# EAGLE design main (EAGLE 7.2.0)
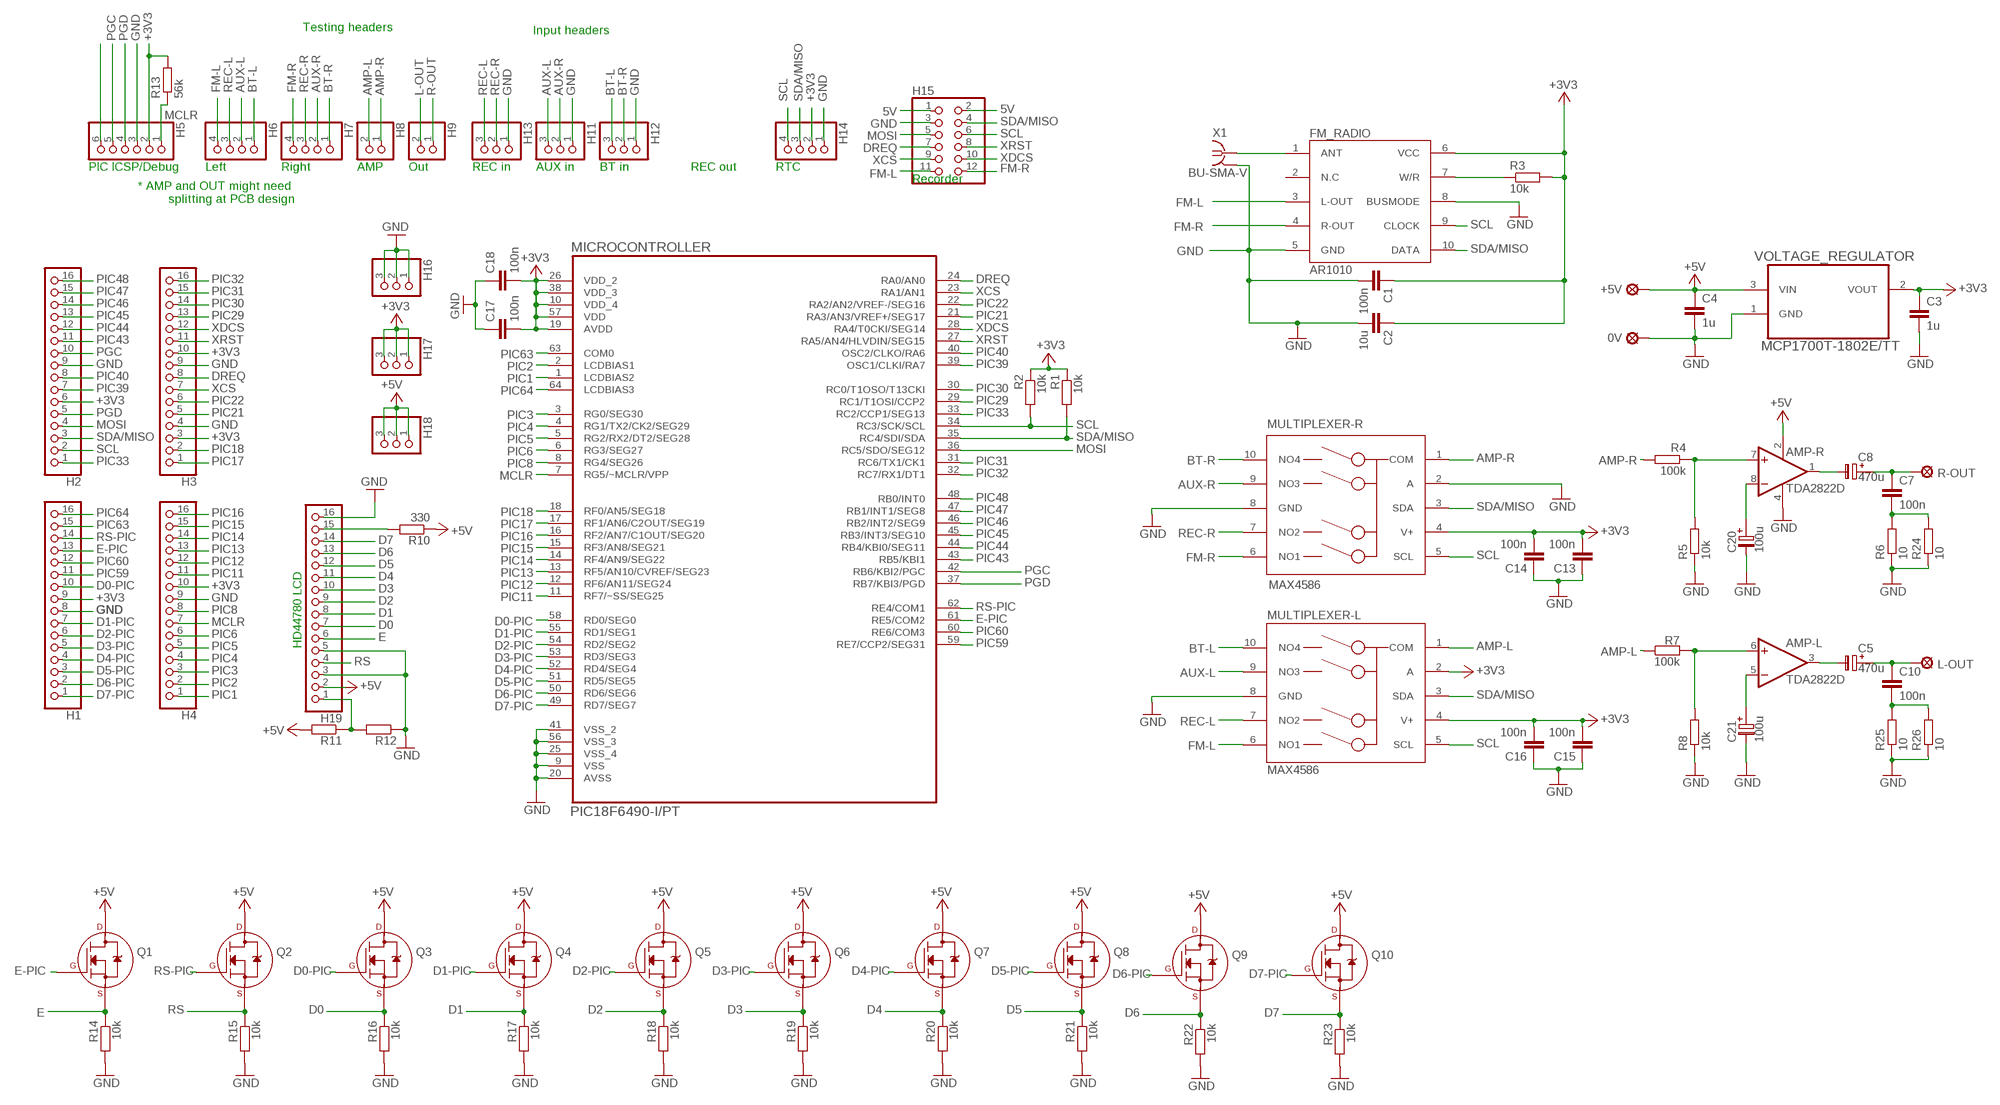
[diagram p0: schematic, sheet 1]

## Parts
0V  LSP11  [LSP11]
+5V  LSP11  [LSP11]
AMP-  TDA2822D  [SO08]
C1  100n  C-EUC0805  [C0805]
C2  10u  C-EUC0805  [C0805]
C3  1u  C-EUC0805  [C0805]
C4  1u  C-EUC0805  [C0805]
C5  470u  C-PR-SMD-SV-G  [SV-G]
C7  100n  C-EUC0805  [C0805]
C8  470u  C-PR-SMD-SV-G  [SV-G]
C10  100n  C-EUC0805  [C0805]
C13  100n  C-EUC0805  [C0805]
C14  100n  C-EUC0805  [C0805]
C15  100n  C-EUC0805  [C0805]
C16  100n  C-EUC0805  [C0805]
C17  100n  C-EUC0805  [C0805]
C18  100n  C-EUC0805  [C0805]
C20  100u  C-PR-SMD-SV-D  [SV-D]
C21  100u  C-PR-SMD-SV-D  [SV-D]
H1  PINHD-1X16  [1X16]
H2  PINHD-1X16  [1X16]
H3  PINHD-1X16  [1X16]
H4  PINHD-1X16  [1X16]
H5  PINHD-1X6  [1X06]
H6  PINHD-1X4  [1X04]
H7  PINHD-1X4  [1X04]
H8  PINHD-1X2  [1X02]
H9  PINHD-1X2  [1X02]
H11  PINHD-1X3  [1X03]
H12  PINHD-1X3  [1X03]
H13  PINHD-1X3  [1X03]
H14  PINHD-1X4/90  [1X04/90]
H15  PINHD-2X6  [2X06]
H16  PINHD-1X3  [1X03]
H17  PINHD-1X3  [1X03]
H18  PINHD-1X3  [1X03]
H19  PINHD-1X16  [1X16]
L-OUT  LSP10  [LSP10]
MICROCONTROLLER  PIC18F6490-I/PT  [QFP50P1200X1200X120-64N]
Q1  2N7000_SOT23  [SOT-23]
Q2  2N7000_SOT23  [SOT-23]
Q3  2N7000_SOT23  [SOT-23]
Q4  2N7000_SOT23  [SOT-23]
Q5  2N7000_SOT23  [SOT-23]
Q6  2N7000_SOT23  [SOT-23]
Q7  2N7000_SOT23  [SOT-23]
Q8  2N7000_SOT23  [SOT-23]
Q9  2N7000_SOT23  [SOT-23]
Q10  2N7000_SOT23  [SOT-23]
R1  10k  R-EU_M0805  [M0805]
R2  10k  R-EU_M0805  [M0805]
R3  10k  R-EU_M0805  [M0805]
R4  100k  R-EU_M0805  [M0805]
R5  10k  R-EU_M0805  [M0805]
R6  10  R-EU_M0805  [M0805]
R7  100k  R-EU_M0805  [M0805]
R8  10k  R-EU_M0805  [M0805]
R10  330  R-EU_M0805  [M0805]
R11  R-EU_M0805  [M0805]
R12  R-EU_M0805  [M0805]
R13  56k  R-EU_M0805  [M0805]
R14  10k  R-EU_M0805  [M0805]
R15  10k  R-EU_M0805  [M0805]
R16  10k  R-EU_M0805  [M0805]
R17  10k  R-EU_M0805  [M0805]
R18  10k  R-EU_M0805  [M0805]
R19  10k  R-EU_M0805  [M0805]
R20  10k  R-EU_M0805  [M0805]
R21  10k  R-EU_M0805  [M0805]
R22  10k  R-EU_M0805  [M0805]
R23  10k  R-EU_M0805  [M0805]
R24  10  R-EU_M0805  [M0805]
R25  10  R-EU_M0805  [M0805]
R26  10  R-EU_M0805  [M0805]
R-OUT  LSP10  [LSP10]
U$1  MAX4586  [UMAX10]
U$2  AR1010  [AR1010]
U$3  MAX4586  [UMAX10]
VOLTAGE_REGULATOR  MCP1700T-1802E/TT  [SOT95P237X112-3N]
X1  BU-SMA-V  [BU-SMA-V]

## Nets
5V: H15.1 H15.2
+3V3: C1.1 C2.1 C3.1 C13.2 C14.2 C15.2 C16.2 C17.2 C18.2 H1.9 H2.6 H3.3 H3.10 H4.10 H5.2 H14.2 H17.1 H17.2 H17.3 MICROCONTROLLER.10(VDD_4) MICROCONTROLLER.19(AVDD) MICROCONTROLLER.26(VDD_2) MICROCONTROLLER.38(VDD_3) MICROCONTROLLER.57(VDD) R1.1 R2.1 R3.2 R13.2 U$1.4(V+) U$2.6(VCC) U$3.2(A) U$3.4(V+) VOLTAGE_REGULATOR.2(VOUT)
+5V: +5V.MP AMP-.2(R:V+) C4.1 H18.1 H18.2 H18.3 H19.2 Q1.3(D) Q2.3(D) Q3.3(D) Q4.3(D) Q5.3(D) Q6.3(D) Q7.3(D) Q8.3(D) Q9.3(D) Q10.3(D) R10.1 R11.2 VOLTAGE_REGULATOR.3(VIN)
AMP-L: H8.2 R7.1 U$3.1(COM)
AMP-R: H8.1 R4.2 U$1.1(COM)
AUX-L: H6.2 H11.3 U$3.9(NO3)
AUX-R: H7.2 H11.2 U$1.9(NO3)
BT-L: H6.1 H12.3 U$3.10(NO4)
BT-R: H7.1 H12.2 U$1.10(NO4)
D0: H19.7 Q3.2(S) R16.1
D0-PIC: H1.10 MICROCONTROLLER.58(RD0/SEG0) Q3.1(G)
D1: H19.8 Q4.2(S) R17.1
D1-PIC: H1.7 MICROCONTROLLER.55(RD1/SEG1) Q4.1(G)
D2: H19.9 Q5.2(S) R18.1
D2-PIC: H1.6 MICROCONTROLLER.54(RD2/SEG2) Q5.1(G)
D3: H19.10 Q6.2(S) R19.1
D3-PIC: H1.5 MICROCONTROLLER.53(RD3/SEG3) Q6.1(G)
D4: H19.11 Q7.2(S) R20.1
D4-PIC: H1.4 MICROCONTROLLER.52(RD4/SEG4) Q7.1(G)
D5: H19.12 Q8.2(S) R21.1
D5-PIC: H1.3 MICROCONTROLLER.51(RD5/SEG5) Q8.1(G)
D6: H19.13 Q9.2(S) R22.1
D6-PIC: H1.2 MICROCONTROLLER.50(RD6/SEG6) Q9.1(G)
D7: H19.14 Q10.2(S) R23.1
D7-PIC: H1.1 MICROCONTROLLER.49(RD7/SEG7) Q10.1(G)
DREQ: H3.8 H15.7 MICROCONTROLLER.24(RA0/AN0)
E: H19.6 Q1.2(S) R14.1
E-PIC: H1.13 MICROCONTROLLER.61(RE5/COM2) Q1.1(G)
FM-L: H6.4 H15.11 U$2.3(L-OUT) U$3.6(NO1)
FM-R: H7.4 H15.12 U$1.6(NO1) U$2.4(R-OUT)
GND: 0V.MP AMP-.4(R:V-) C1.2 C2.2 C3.2 C4.2 C13.1 C14.1 C15.1 C16.1 C17.1 C18.1 C20.- C21.- H1.8 H2.9 H3.4 H3.9 H4.9 H5.3 H11.1 H12.1 H13.1 H14.1 H15.3 H16.1 H16.2 H16.3 H19.3 H19.5 H19.16 MICROCONTROLLER.9(VSS) MICROCONTROLLER.20(AVSS) MICROCONTROLLER.25(VSS_4) MICROCONTROLLER.41(VSS_2) MICROCONTROLLER.56(VSS_3) R5.1 R6.1 R8.1 R12.1 R14.2 R15.2 R16.2 R17.2 R18.2 R19.2 R20.2 R21.2 R22.2 R23.2 R24.1 R25.1 R26.1 U$1.2(A) U$1.8(GND) U$2.5(GND) U$2.8(BUSMODE) U$3.8(GND) VOLTAGE_REGULATOR.1(GND) X1.2 X1.3 X1.4 X1.5
L-OUT: C5.+ C10.1 H9.2 L-OUT.MP
MCLR: H4.7 H5.1 MICROCONTROLLER.7(RG5/~MCLR/VPP) R13.1
MOSI: H2.4 H15.5 MICROCONTROLLER.36(RC5/SDO/SEG12)
N$1: AMP-.8(R:-IN) C20.+
N$3: R3.1 U$2.7(W/R)
N$4: U$2.1(ANT) X1.1
N$5: AMP-.3(L:OUT) C5.-
N$7: AMP-.1(R:OUT) C8.-
N$8: AMP-.7(R:+IN) R4.1 R5.2
N$10: C10.2 R25.2 R26.2
N$13: H19.1 R11.1 R12.2
N$14: AMP-.5(L:-IN) C21.+
N$17: AMP-.6(L:+IN) R7.2 R8.2
N$18: H5.6
N$20: H19.15 R10.2
N$61: C7.2 R6.2 R24.2
PGC: H2.10 H5.5 MICROCONTROLLER.42(RB6/KBI2/PGC)
PGD: H2.5 H5.4 MICROCONTROLLER.37(RB7/KBI3/PGD)
PIC1: H4.1 MICROCONTROLLER.1(LCDBIAS2)
PIC2: H4.2 MICROCONTROLLER.2(LCDBIAS1)
PIC3: H4.3 MICROCONTROLLER.3(RG0/SEG30)
PIC4: H4.4 MICROCONTROLLER.4(RG1/TX2/CK2/SEG29)
PIC5: H4.5 MICROCONTROLLER.5(RG2/RX2/DT2/SEG28)
PIC6: H4.6 MICROCONTROLLER.6(RG3/SEG27)
PIC8: H4.8 MICROCONTROLLER.8(RG4/SEG26)
PIC11: H4.11 MICROCONTROLLER.11(RF7/~SS/SEG25)
PIC12: H4.12 MICROCONTROLLER.12(RF6/AN11/SEG24)
PIC13: H4.13 MICROCONTROLLER.13(RF5/AN10/CVREF/SEG23)
PIC14: H4.14 MICROCONTROLLER.14(RF4/AN9/SEG22)
PIC15: H4.15 MICROCONTROLLER.15(RF3/AN8/SEG21)
PIC16: H4.16 MICROCONTROLLER.16(RF2/AN7/C1OUT/SEG20)
PIC17: H3.1 MICROCONTROLLER.17(RF1/AN6/C2OUT/SEG19)
PIC18: H3.2 MICROCONTROLLER.18(RF0/AN5/SEG18)
PIC21: H3.5 MICROCONTROLLER.21(RA3/AN3/VREF+/SEG17)
PIC22: H3.6 MICROCONTROLLER.22(RA2/AN2/VREF-/SEG16)
PIC29: H3.13 MICROCONTROLLER.29(RC1/T1OSI/CCP2)
PIC30: H3.14 MICROCONTROLLER.30(RC0/T1OSO/T13CKI)
PIC31: H3.15 MICROCONTROLLER.31(RC6/TX1/CK1)
PIC32: H3.16 MICROCONTROLLER.32(RC7/RX1/DT1)
PIC33: H2.1 MICROCONTROLLER.33(RC2/CCP1/SEG13)
PIC39: H2.7 MICROCONTROLLER.39(OSC1/CLKI/RA7)
PIC40: H2.8 MICROCONTROLLER.40(OSC2/CLKO/RA6)
PIC43: H2.11 MICROCONTROLLER.43(RB5/KBI1)
PIC44: H2.12 MICROCONTROLLER.44(RB4/KBI0/SEG11)
PIC45: H2.13 MICROCONTROLLER.45(RB3/INT3/SEG10)
PIC46: H2.14 MICROCONTROLLER.46(RB2/INT2/SEG9)
PIC47: H2.15 MICROCONTROLLER.47(RB1/INT1/SEG8)
PIC48: H2.16 MICROCONTROLLER.48(RB0/INT0)
PIC59: H1.11 MICROCONTROLLER.59(RE7/CCP2/SEG31)
PIC60: H1.12 MICROCONTROLLER.60(RE6/COM3)
PIC63: H1.15 MICROCONTROLLER.63(COM0)
PIC64: H1.16 MICROCONTROLLER.64(LCDBIAS3)
R-OUT: C7.1 C8.+ H9.1 R-OUT.MP
REC-L: H6.3 H13.3 U$3.7(NO2)
REC-R: H7.3 H13.2 U$1.7(NO2)
RS: H19.4 Q2.2(S) R15.1
RS-PIC: H1.14 MICROCONTROLLER.62(RE4/COM1) Q2.1(G)
SCL: H2.2 H14.4 H15.6 MICROCONTROLLER.34(RC3/SCK/SCL) R2.2 U$1.5(SCL) U$2.9(CLOCK) U$3.5(SCL)
SDA/MISO: H2.3 H14.3 H15.4 MICROCONTROLLER.35(RC4/SDI/SDA) R1.2 U$1.3(SDA) U$2.10(DATA) U$3.3(SDA)
XCS: H3.7 H15.9 MICROCONTROLLER.23(RA1/AN1)
XDCS: H3.12 H15.10 MICROCONTROLLER.28(RA4/T0CKI/SEG14)
XRST: H3.11 H15.8 MICROCONTROLLER.27(RA5/AN4/HLVDIN/SEG15)
Unconnected: U$2.2(N.C)

## Notes on the sheet
- Testing headers | Input headers
- PIC ICSP/Debug | Left | Right | AMP | Out | REC in | AUX in | BT in | REC out | RTC
- * AMP and OUT might need 
     splitting at PCB design
- Recorder
- HD44780 LCD

## Library data of the parts
0V +5V = solpad:LSP11: SOLDER PAD drill 1.1 mm
AMP- = linear:TDA2822: Power OP AMP
C1-C4 C7 C10 C13-C18 = rcl:C-EU: CAPACITOR, European symbol
C5 C8 C20 C21 = cap-pan40:C-PR: POLARIZED ELECTROLYTIC/TANTALUM
H1-H4 H19 = pinhead:PINHD-1X16: PIN HEADER
H5 = pinhead:PINHD-1X6: PIN HEADER
H6 H7 H14 = pinhead:PINHD-1X4: PIN HEADER
H8 H9 = pinhead:PINHD-1X2: PIN HEADER
H11-H13 H16-H18 = pinhead:PINHD-1X3: PIN HEADER
H15 = pinhead:PINHD-2X6: PIN HEADER
L-OUT R-OUT = solpad:LSP10: SOLDER PAD drill 1.0 mm, distributor Buerklin, 12H555
MICROCONTROLLER = Microchip_By_element14_Batch_1:PIC18F6490-I/PT: IC PIC MCU; MPN: PIC18F6490-I/PT; OC_FARNELL: 1332278; OC_NEWARK: 08J9646; PACKAGE: QFP-64; SUPPLIER: Microchip
Q1-Q10 = transistors:2N700*: 2N7000, 2N7002, NDS7002A N-channel enhancement mode MOSFET
R1-R8 R10-R26 = resistor:R-EU_: RESISTOR, European symbol
U$1 U$3 = MAX4586:MAX4586; VAL: MAX4586
U$2 = ar1010:AR1010; VAL: AR1010
VOLTAGE_REGULATOR = mcp1700t-vreg:MCP1700T-1802E/TT: Low Quiescent Current LDO; MPN: MCP1700T-1802E/TT; OC_FARNELL: 1296591; OC_NEWARK: 84R5175; PACKAGE: SOT23-3; SUPPLIER: Microchip
X1 = con-coax:BU-SMA-V: FEMALE SMA CONNECTOR Radiall distributor RS 112-3794; OC_FARNELL: unknown; OC_NEWARK: unknown

## Board
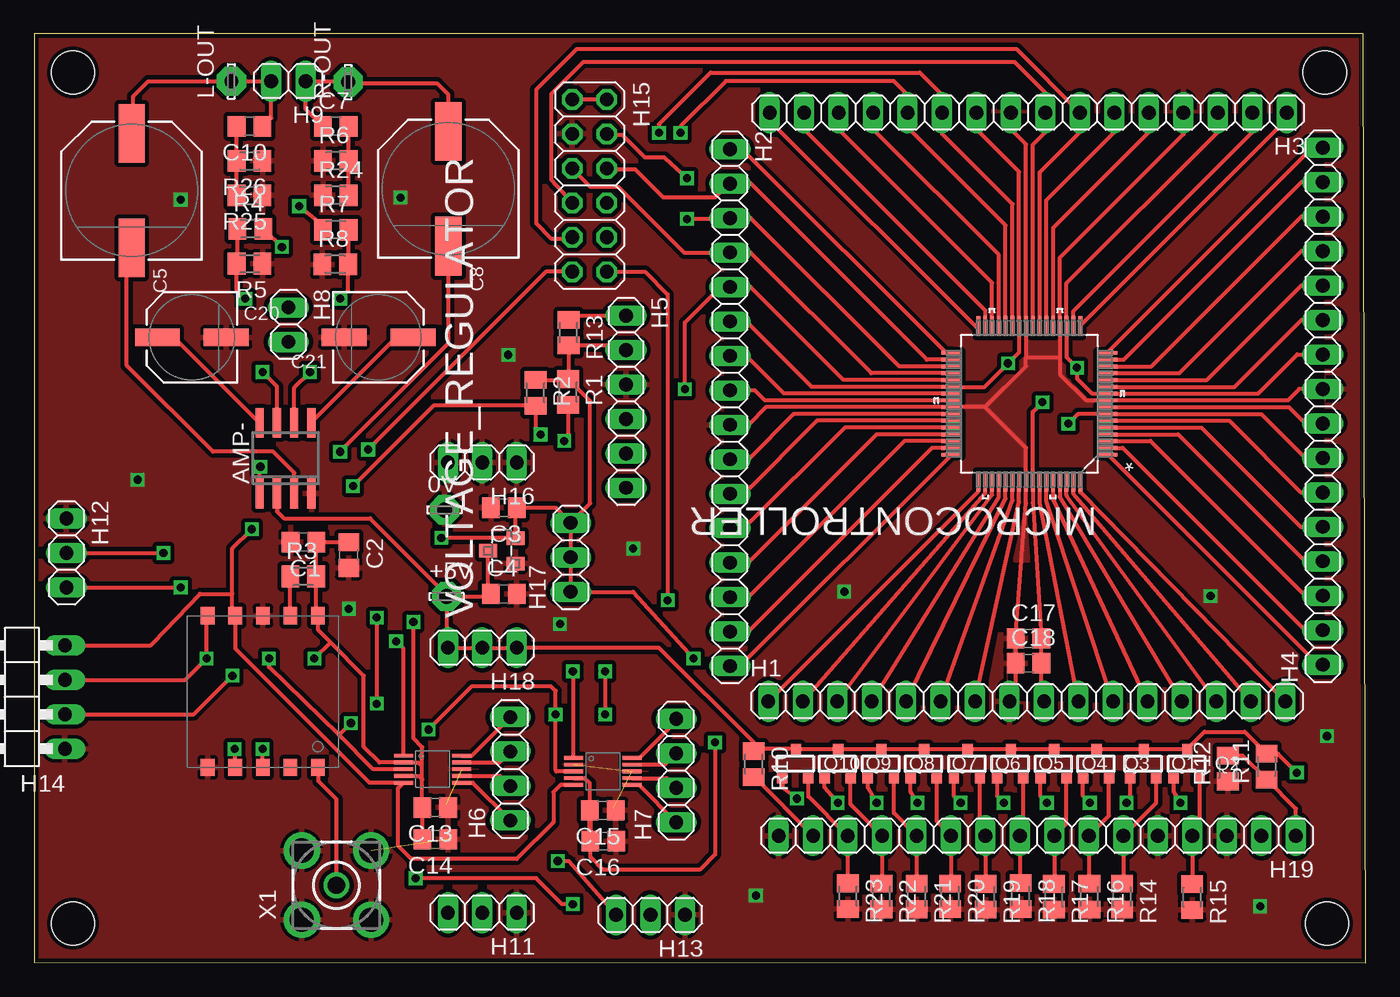
[diagram p1: board, top side]
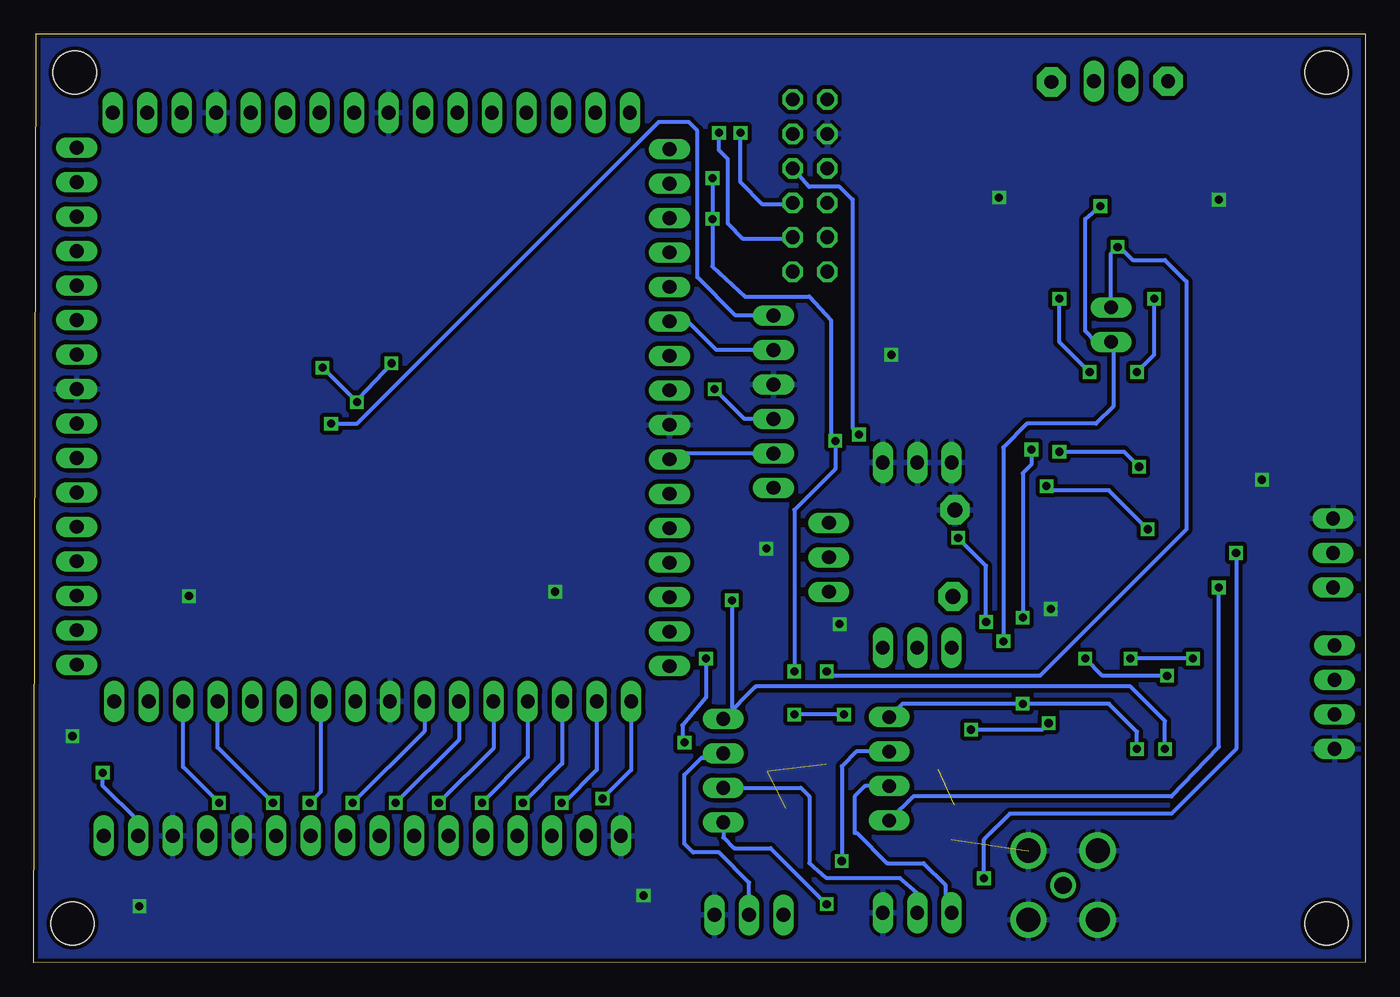
[diagram p2: board, bottom side, seen from below]

Size 98.09 x 68.46 mm. Coordinates in mm from the lower left corner, seen from the top.
Outline: 0,0.05 98.09,0 97.94,68.46 0,68.46 0,0.05
Copper layers (1*16): Top 0.035mm / dielectric 1.5mm / Bottom 0.035mm
Design rules "electrodragon": minimum track width 6mil, minimum drill 12mil, track to track 6mil, track to pad 6mil, pad to pad 6mil, via to via 6mil, smd to smd 0mil, copper to edge 8mil, drill to drill 6mil, minimum pad ring 10mil, minimum via ring 8mil, stop-mask expansion 4mil, vias tented up to drill 0mil, thermal gap 10mil
Holes 3.2 mm at 2.86,65.61 95.09,65.61 95.25,2.9 2.86,2.9
tRestrict: area 51.3,23.9 to 66.2,53.1; area 65.6,48.5 to 91.3,62.1; area 80,24.2 to 94.9,60.4; area 64.3,19.3 to 71.4,29.1; area 72.1,19.6 to 82.4,28.9; area 70.6,24.8 to 75.2,29.1; area 65.6,63.2 to 74.8,66.4

### Footprints (pad centres in the part's own frame; a part is rotated, then mirrored left to right if it is on the bottom)
LSP11 = drill 1.118 pad 2.159 octagon: MP 0,0
SO08 = smd 0.6 x 2.2: 1 -1.905,-2.6; 2 -0.635,-2.6; 3 0.635,-2.6; 4 1.905,-2.6; 5 1.905,2.6; 6 0.635,2.6; 7 -0.635,2.6; 8 -1.905,2.6
C0805 = smd 1.3 x 1.5: 1 -0.95,0; 2 0.95,0
SV-G = smd 4.318 x 1.93: + -4.223,0; - 4.223,0
SV-D = smd 3.302 x 1.27: + -2.54,0; - 2.54,0
1X16 = drill 1.016 long: 1 -19.05,0; 2 -16.51,0; 3 -13.97,0; 4 -11.43,0; 5 -8.89,0; 6 -6.35,0; 7 -3.81,0; 8 -1.27,0; 9 1.27,0; 10 3.81,0; 11 6.35,0; 12 8.89,0; 13 11.43,0; 14 13.97,0; 15 16.51,0; 16 19.05,0
1X06 = drill 1.016 long: 1 -6.35,0; 2 -3.81,0; 3 -1.27,0; 4 1.27,0; 5 3.81,0; 6 6.35,0
1X04 = drill 1.016 long: 1 -3.81,0; 2 -1.27,0; 3 1.27,0; 4 3.81,0
1X02 = drill 1.016 long: 1 -1.27,0; 2 1.27,0
1X03 = drill 1.016 long: 1 -2.54,0; 2 0,0; 3 2.54,0
1X04/90 = drill 1.016 long: 1 -3.81,-3.81; 2 -1.27,-3.81; 3 1.27,-3.81; 4 3.81,-3.81
2X06 = drill 1.016 octagon: 1 -6.35,-1.27; 2 -6.35,1.27; 3 -3.81,-1.27; 4 -3.81,1.27; 5 -1.27,-1.27; 6 -1.27,1.27; 7 1.27,-1.27; 8 1.27,1.27; 9 3.81,-1.27; 10 3.81,1.27; 11 6.35,-1.27; 12 6.35,1.27
LSP10 = drill 1.016 pad 2.159 octagon: MP 0,0
QFP50P1200X1200X120-64N = smd 1.473 x 0.279: 1 -5.74,3.759; 2 -5.74,3.251; 3 -5.74,2.743; 4 -5.74,2.261; 5 -5.74,1.753; 6 -5.74,1.245; 7 -5.74,0.762; 8 -5.74,0.254; 9 -5.74,-0.254; 10 -5.74,-0.762; 11 -5.74,-1.245; 12 -5.74,-1.753; 13 -5.74,-2.261; 14 -5.74,-2.743; 15 -5.74,-3.251; 16 -5.74,-3.759; 33 5.74,-3.759; 34 5.74,-3.251; 35 5.74,-2.743; 36 5.74,-2.261; 37 5.74,-1.753; 38 5.74,-1.245; 39 5.74,-0.762; 40 5.74,-0.254; 41 5.74,0.254; 42 5.74,0.762; 43 5.74,1.245; 44 5.74,1.753; 45 5.74,2.261; 46 5.74,2.743; 47 5.74,3.251; 48 5.74,3.759 | smd 0.279 x 1.473: 17 -3.759,-5.74; 18 -3.251,-5.74; 19 -2.743,-5.74; 20 -2.261,-5.74; 21 -1.753,-5.74; 22 -1.245,-5.74; 23 -0.762,-5.74; 24 -0.254,-5.74; 25 0.254,-5.74; 26 0.762,-5.74; 27 1.245,-5.74; 28 1.753,-5.74; 29 2.261,-5.74; 30 2.743,-5.74; 31 3.251,-5.74; 32 3.759,-5.74; 49 3.759,5.74; 50 3.251,5.74; 51 2.743,5.74; 52 2.261,5.74; 53 1.753,5.74; 54 1.245,5.74; 55 0.762,5.74; 56 0.254,5.74; 57 -0.254,5.74; 58 -0.762,5.74; 59 -1.245,5.74; 60 -1.753,5.74; 61 -2.261,5.74; 62 -2.743,5.74; 63 -3.251,5.74; 64 -3.759,5.74
SOT-23 = smd 0.762 x 0.762: 1 -0.979,-1.101; 2 0.94,-1.101; 3 0.025,1.067
M0805 = smd 1.3 x 1.6: 1 -0.95,0; 2 0.95,0
UMAX10 = smd 1.4 x 0.28: 1 -6.6,4.75; 2 -6.6,4.25; 3 -6.6,3.75; 4 -6.6,3.25; 5 -6.6,2.75; 6 -2.32,4.75; 7 -2.32,4.25; 8 -2.32,3.75; 9 -2.32,3.25; 10 -2.32,2.75
AR1010 = smd 1.27 x 1.016: 1 -18.034,-0.508; 2 -18.034,-2.54; 3 -18.034,-4.572; 4 -18.034,-6.604; 5 -18.034,-8.636; 6 -29.21,-0.508; 7 -29.21,-2.54; 8 -29.21,-4.572; 9 -29.21,-6.604; 10 -29.21,-8.636
SOT95P237X112-3N = smd 0.991 x 1.321: 1 -0.94,-1.016; 2 0.94,-1.016; 3 0,1.016
BU-SMA-V = drill 1.27: 1 0,0 | drill 1.778: 2 -2.55,2.55; 3 2.55,2.55; 4 2.55,-2.55; 5 -2.55,-2.55

### Placement (x,y rotation side)
0V  30.24,33.38 0 top
+5V  30.38,27.01 0 top
AMP-  18.52,37.2 0 top
C1  19.84,31 180 top
C2  23.18,30.05 270 top
C3  34.61,33.54 180 top
C4  34.61,27.19 0 top
C5  7.18,56.91 270 top
C7  22.22,61.64 0 top
C8  30.51,57.05 270 top
C10  15.88,61.64 180 top
C13  29.55,11.46 180 top
C14  29.56,9.11 180 top
C15  41.9,11.25 180 top
C16  41.93,8.98 180 top
C17  73.26,23.91 0 top
C18  73.26,22.09 0 top
C20  11.62,46.09 0 top
C21  25.37,46.09 180 top
H1  73.14,19.27 0 top
H2  51.26,40.92 270 top
H3  73.24,62.66 180 top
H4  94.94,41.02 90 top
H5  43.61,41.36 270 top
H6  35.08,14.3 90 top
H7  47.31,14.18 90 top
H8  18.73,47.04 270 top
H9  18.73,64.98 180 top
H11  33.02,3.7 180 top
H12  2.38,30.21 270 top
H13  45.4,3.54 180 top
H14  -1.54,19.59 90 top
H15  40.92,57.28 270 top
H16  33.02,36.88 180 top
H17  39.53,29.89 90 top
H18  33.02,23.22 180 top
H19  73.91,9.38 180 top
L-OUT  14.53,64.97 90 top
MICROCONTROLLER  73.32,41.2 180 top
Q1  81.73,14.7 0 top
Q2  84.94,14.7 0 top
Q3  78.25,14.7 0 top
Q4  75.13,14.7 0 top
Q5  71.94,14.7 0 top
Q6  68.75,14.7 0 top
Q7  65.55,14.7 0 top
Q8  62.4,14.7 0 top
Q9  59.21,14.7 0 top
Q10  56.1,14.7 0 top
R1  39.33,42.07 270 top
R2  36.95,42.01 270 top
R3  19.83,28.47 0 top
R4  15.94,54.09 0 top
R5  15.87,51.54 180 top
R6  22.22,59.1 0 top
R7  22.22,54.02 0 top
R8  22.18,51.48 0 top
R10  53.02,14.65 270 top
R11  90.8,14.46 90 top
R12  87.95,14.33 90 top
R13  39.37,46.45 270 top
R14  80.16,4.89 270 top
R15  85.32,4.86 270 top
R16  77.75,4.89 270 top
R17  75.13,4.88 270 top
R18  72.68,4.93 270 top
R19  70.11,4.88 270 top
R20  67.49,4.91 270 top
R21  65.01,4.9 270 top
R22  62.43,4.9 270 top
R23  59.97,4.92 270 top
R24  22.22,56.56 0 top
R25  15.88,56.56 180 top
R26  15.88,59.1 180 top
R-OUT  23.13,64.91 90 top
U$1  46.35,10.37 0 top
U$2  21.42,-3.63 270 top
U$3  33.81,10.52 0 top
VOLTAGE_REGULATOR  34.45,30.37 90 top
X1  22.27,5.73 90 top

### Tracks (layer width: path | path; a pad name or v marks a point on that pad's centre or on a via)
5V
  Top 0.305: H15.1 H15.2
+3V3  (via drill 0.6)
  Top 0.305: MICROCONTROLLER.10 90.18,41.96 93.05,44.84 H4.10 | MICROCONTROLLER.10 78.73,41.96 | v74.3,41.32 73.58,40.6 MICROCONTROLLER.57 73.58,33.91 C17.2 C18.2 74.21,19.63 H1.9 | R1.1 39.37,43.06 R13.2 43.27,45.5 H5.2 | R2.1 39.27,42.96 R1.1 | C15.2 40.95,13.23 40.56,13.62 U$1.4 | 28.6,13.52 C13.2 28.61,11.44 C14.2 | 28.6,13.52 28.34,13.77 | U$3.4 28.34,13.77 | 28.34,13.77 28.5,13.77 28.57,13.7 28.57,14.49 28.29,14.77 U$3.2 25.44,14.77 24.29,15.92 24.29,21.16 21.83,23.62 | R1.1 40.96,41.39 40.96,33.86 H17.3 | v48.58,22.43 44.13,27.35 H17.1 H17.2 H17.3 | v50.16,16.24 50.16,7.99 49.05,6.87 41.91,6.87 40.98,7.81 C16.2 | v30,31.32 v30.02,31.31 VOLTAGE_REGULATOR.2 35.46,33.45 C3.1 38.42,33.54 H17.3 | 28.6,13.52 28.6,15.9 27.94,16.56 v27.94,25.13 | v20.64,22.43 21.83,23.62 | MICROCONTROLLER.10 77.95,41.96 76.83,43.07 v76.83,43.86 76.07,44.63 MICROCONTROLLER.19 76.07,50.08 87.21,61.23 H3.3 | H2.6 52.47,47.27 57.3,42.45 MICROCONTROLLER.38 70.02,42.45 v71.75,44.18 72.56,44.99 MICROCONTROLLER.26 72.56,58.3 69.43,61.42 H3.10 | C2.1 C1.1 20.79,28.47 R3.2 20.78,25.58 U$2.6 20.91,24.54 21.83,23.62 | H14.2 11.76,18.32 v14.61,21.16
  Top 0.406: C15.2 40.95,9.01 C16.2 | 28.6,9.12 C14.2
  Bottom 0.305: v76.83,43.86 v74.3,41.32 74.14,41.64 v71.75,44.18 | v48.58,22.43 48.58,19.57 50.32,17.51 50.32,16.4 v50.16,16.24 | v27.94,25.13 27.94,29.26 v30,31.32 | v14.61,21.16 19.37,21.16 v20.64,22.43 | H5.2 47.82,45.17 49.85,47.2 51.19,47.2 H2.6
+5V  (via drill 0.6)
  Top 0.305: AMP-.2 17.89,33.27 18.41,32.75 24.77,32.75 30.38,27.13 +5V.MP | +5V.MP 30.38,23.32 H18.3 H18.2 H18.1 46.04,23.22 53.02,16.24 53.02,15.76 Q10.3 Q9.3 | v93.03,14.02 91.63,15.41 R11.2 89.18,17.03 86.23,17.03 Q2.3 Q1.3 Q3.3 Q4.3 Q5.3 Q6.3 Q7.3 | Q9.3 Q8.3 Q7.3 | +5V.MP 30.38,27.19 | VOLTAGE_REGULATOR.3 33.43,27.19 C4.1 33.66,27.01 +5V.MP
  Top 0.406: Q9.3 | Q7.3 | 53.02,15.76 R10.1
  Bottom 0.305: H19.2 90.41,10.45 93.03,13.07 v93.03,14.02
AMP-L  (via drill 0.6)
  Top 0.305: R7.1 21.27,54.34 v19.53,55.77 | U$3.1 27.21,23.16 v26.67,23.7
  Bottom 0.305: v19.53,55.77 20.64,54.82 20.64,46.56 19.84,45.77 H8.2 18.57,45.77 18.57,41.01 19.84,39.74 24.92,39.74 26.67,37.99 v26.67,23.7
AMP-R  (via drill 0.6)
  Top 0.305: R4.2 16.92,54.09 v18.26,52.75 | U$1.1 39.75,21.41 v39.69,21.48
  Bottom 0.305: H8.1 18.73,52.28 v18.26,52.75 18.1,52.75 17.14,51.8 14.76,51.8 13.18,50.21 13.18,31.96 23.97,21.16 39.37,21.16 v39.69,21.48
AUX-L
  Top 0.305: U$3.9 34.34,13.77 H6.2
  Bottom 0.305: H6.2 36.86,13.03 37.62,12.27 37.62,9.57 37.46,9.57 35.24,7.35 32.54,7.35 30.96,5.76 30.96,4.18 H11.3
AUX-R
  Top 0.305: U$1.9 46.6,13.62 H7.2
  Bottom 0.305: H7.2 41.59,12.91 40.96,12.27 40.96,7.35 39.69,6.24 34.29,6.24 33.02,5.13 H11.2
BT-L  (via drill 0.6)
  Top 0.305: U$3.10 32.3,13.27 H6.1 | H12.3 v10.79,27.67
  Bottom 0.305: v10.79,27.67 10.79,15.92 14.29,12.27 33.31,12.27 H6.1
BT-R  (via drill 0.6)
  Top 0.305: U$1.10 44.56,13.12 H7.1 | H12.2 v9.53,30.21 | v28.1,6.24 36.99,6.24 38.89,4.33 v39.69,4.33
  Bottom 0.305: v9.53,30.21 9.53,15.76 14.29,11 26.19,11 28.1,9.1 v28.1,6.24 | H7.1 47.31,9.25 46.51,8.46 43.81,8.46 v39.69,4.33
D0
  Top 0.305: 77.72,5.87 H19.7 79.19,10.85 Q3.2
  Top 0.406: 77.72,5.87 R16.1
D0-PIC  (via drill 0.6)
  Top 0.305: v77.79,11.8 77.27,12.31 Q3.1 | H1.10 74.08,33.89 MICROCONTROLLER.58
  Bottom 0.305: v77.79,11.8 76.95,12.64 H1.10
D1
  Top 0.305: 75.17,5.88 H19.8 76.07,10.27 Q4.2
  Top 0.406: 75.17,5.88 R17.1
D1-PIC  (via drill 0.6)
  Top 0.305: v74.61,11.8 74.15,12.26 Q4.1 | 72.55,35.45 MICROCONTROLLER.55 72.56,33.94 H1.7
  Bottom 0.305: H1.7 69.33,17.08 v74.61,11.8
D2
  Top 0.305: 72.64,5.93 H19.9 72.88,9.62 Q5.2
  Top 0.406: 72.64,5.93 R18.1
D2-PIC  (via drill 0.6)
  Top 0.305: v71.44,11.8 70.96,12.28 Q5.1 | H1.6 72.08,34.09 MICROCONTROLLER.54
  Bottom 0.305: H1.6 66.79,16.45 v71.44,11.8
D3
  Top 0.305: 70.09,5.85 H19.10 69.69,9.78 Q6.2
  Top 0.406: 70.09,5.85 R19.1
D3-PIC  (via drill 0.6)
  Top 0.305: v68.26,11.8 67.77,12.29 Q6.1 | H1.5 71.57,34.22 MICROCONTROLLER.53
  Bottom 0.305: H1.5 64.25,15.81 v68.26,11.8
D4
  Top 0.305: 67.55,5.92 H19.11 66.5,10.44 Q7.2
  Top 0.406: 67.55,5.92 R20.1
D4-PIC  (via drill 0.6)
  Top 0.305: v65.09,11.8 64.58,12.62 Q7.1 | H1.4 71.06,34.34 MICROCONTROLLER.52
  Bottom 0.305: H1.4 61.71,15.17 v65.09,11.8
D5
  Top 0.305: R21.1 H19.12 63.34,11.05 Q8.2
  Top 0.406: R21.1
D5-PIC  (via drill 0.6)
  Top 0.305: v62.07,11.8 61.42,12.92 Q8.1 | H1.3 70.58,34.5 MICROCONTROLLER.51
  Bottom 0.305: H1.3 59.17,14.7 v62.07,11.8
D6
  Top 0.305: 62.47,5.9 H19.13 60.15,11.7 Q9.2
  Top 0.406: 62.47,5.9 R22.1
D6-PIC  (via drill 0.6)
  Top 0.305: v59.21,11.8 58.23,12.93 Q9.1 | H1.2 70.07,34.62 MICROCONTROLLER.50
  Bottom 0.305: H1.2 56.63,14.22 59.05,11.8 v59.21,11.8
D7
  Top 0.305: 59.94,5.9 H19.14 57.04,12.27 Q10.2
  Top 0.406: 59.94,5.9 R23.1 | 57.15,13.49 Q10.2
D7-PIC  (via drill 0.6)
  Top 0.305: Q10.1 55.12,12.94 v56.2,12.11 | H1.1 69.56,34.75 MICROCONTROLLER.49
  Bottom 0.305: H1.1 54.09,14.22 v56.2,12.11
DREQ
  Top 0.305: MICROCONTROLLER.24 73.58,60.29 74.51,61.23 H3.8 74.51,64.12 72.23,66.41 40.48,66.41 38.1,64.02 38.1,57.72 H15.7
E
  Top 0.305: Q1.2 82.67,11.79 H19.6 80.25,5.93 R14.1
  Top 0.406: 82.55,13.48 Q1.2
E-PIC  (via drill 0.6)
  Top 0.305: v80.49,11.8 80.75,12.06 Q1.1 | MICROCONTROLLER.61 75.58,34.36 75.56,34.34 H1.13
  Bottom 0.305: v80.49,11.8 84.57,15.88 H1.13
FM-L  (via drill 0.6)
  Top 0.305: U$2.3 16.85,15.74 v16.83,15.76 | U$3.6 32.24,15.27 H6.4 | H15.11 37.71,50.93 v24.61,37.83 | v25.24,25.45 v25.24,19.1
  Bottom 0.305: v16.83,15.76 16.83,17.03 18.89,19.1 v25.24,19.1 34.1,19.1 H6.4 | v24.61,37.83 24.61,36.72 25.24,36.08 v25.24,25.45
FM-R  (via drill 0.6)
  Top 0.305: U$1.6 44.6,15.12 46.83,17.35 46.83,17.51 H7.4 | U$2.4 14.82,15.71 v14.76,15.76 | H15.12 45,50.93 46.67,49.26 v46.67,26.72
  Bottom 0.305: v14.76,15.76 14.76,17.83 17.3,20.37 44.93,20.37 H7.4 46.67,18.62 v46.67,26.72
GND  (via drill 0.6)  (4 unrouted)
  Top 0.305: H3.4 84.67,61.07 75.58,51.98 MICROCONTROLLER.20 75.58,44.66 | 75.58,44.66 75.58,43.37 77.47,41.48 79.04,41.48 MICROCONTROLLER.9 92.37,41.46 93.21,42.3 H4.9 | 42.7,11.39 C15.1 | 42.85,9.01 C16.1 | 30.32,11.63 C13.1 | 30.5,9.12 C14.1 | 15.56,46.09 C20.- | 21.17,51.54 R8.1 | 17.14,56.72 16.99,56.56 | H2.9 52.62,39.65 53.92,40.95 MICROCONTROLLER.41 70.06,40.95 | H3.9 71.97,61.42 73.07,60.33 MICROCONTROLLER.25 73.07,44.66 | 73.07,44.66 75.58,44.66 | H1.8 72.31,19.88 C18.1 C17.1 73.07,33.88 MICROCONTROLLER.56 73.07,37.95 70.06,40.95 | 70.06,40.95 73.07,43.95 73.07,44.66
  other vias: 23.18,26.08 38.73,24.97 7.62,35.61 10.79,56.24 26.99,56.4 44.13,30.53 95.25,16.72 53.18,4.97 86.68,27.04 59.69,27.35 34.92,44.81 90.33,4.18
  pour Top (isolate 0.305): 0,68.47 97.95,68.47 98.11,0.05 0,0.05
  pour Bottom (isolate 0.305): 0,68.47 97.95,68.47 98.11,0.05 0,0.05
L-OUT
  Top 0.305: C5.+ 7.3,61.26 7.3,63.87 8.41,64.97 L-OUT.MP 14.54,64.98 H9.2 17.46,62.28 C10.1
MCLR  (via drill 0.6)
  Top 0.305: v76.2,39.74 76.91,40.44 MICROCONTROLLER.7 90.42,40.44 93.64,37.21 H4.7 | 39.68,47.71 H5.1
  Top 0.406: 39.68,47.71 R13.1
  Bottom 0.305: v76.2,39.74 74.3,39.74 52.07,61.96 49.85,61.96 49.21,61.33 49.21,50.53 46.39,47.71 H5.1
MOSI
  Top 0.305: MICROCONTROLLER.36 61.68,43.46 52.79,52.35 H2.4 47.87,52.35 43.02,57.2 40.96,57.2 39.81,58.35 H15.5
N$1
  Top 0.305: C20.+ 10.33,46.09 AMP-.8
N$3
  Top 0.305: U$2.7 R3.1
  Top 0.406: U$2.7
N$4
  Top 0.305: X1.1 22.27,12.07 20.95,13.38 20.95,14.36 U$2.1
N$5
  Top 0.305: AMP-.3 19.16,36.13 17.62,37.67 13.18,37.67 6.83,44.02 6.83,52.33 C5.-
N$7  (via drill 0.6)
  Top 0.305: C8.- 30.51,45.64 v22.54,37.67 | AMP-.1 16.62,36.51 v16.67,36.56
  Bottom 0.305: v22.54,37.67 17.78,37.67 v16.67,36.56
N$8  (via drill 0.6)
  Top 0.305: AMP-.7 17.89,42.48 v16.83,43.55 | v15.56,48.94 14.92,49.58 R5.2 | 14.99,51.6 R4.1
  Top 0.406: 14.99,51.6 R5.2
  Bottom 0.305: v16.83,43.55 15.56,44.81 v15.56,48.94
N$10
  Top 0.305: R25.2 R26.2 C10.2
N$13
  Top 0.305: H19.1 92.95,11.36 R11.1 89.03,15.29 88.58,15.29
  Top 0.406: R11.1 90.36,13.51 | 88.58,15.29 R12.2
N$14
  Top 0.305: AMP-.5 20.43,39.84 26.67,46.09 27.9,46.09 C21.+
N$17  (via drill 0.6)
  Top 0.305: AMP-.6 19.16,42.38 v20.32,43.55 | v22.54,48.94 23.13,49.53 R8.2 | 23.17,51.52 R7.2
  Top 0.406: 23.17,51.52 R8.2
  Bottom 0.305: v20.32,43.55 22.54,45.77 v22.54,48.94
N$20
  Top 0.305: H19.15 53.07,13.7 R10.2
N$61
  Top 0.305: R24.2 R6.2 C7.2
PGC
  Top 0.305: MICROCONTROLLER.42 55.95,40.44 52.62,37.11 H2.10
  Bottom 0.305: H5.5 50.83,37.55 H2.10
PGD  (via drill 0.6)
  Top 0.305: MICROCONTROLLER.37 59.64,42.96 52.79,49.81 H2.5 51.19,49.74 50.48,49.74 47.94,47.2 v47.94,42.27
  Bottom 0.305: H5.4 45.75,40.09 v47.94,42.27
PIC1
  Top 0.305: MICROCONTROLLER.1 79.13,37.44 94.59,21.97 H4.1
PIC2
  Top 0.305: MICROCONTROLLER.2 80.21,37.95 93.64,24.52 H4.2
PIC3
  Top 0.305: MICROCONTROLLER.3 82.24,38.46 93.64,27.06 H4.3
PIC4
  Top 0.305: MICROCONTROLLER.4 84.3,38.94 93.64,29.59 H4.4
PIC5
  Top 0.305: MICROCONTROLLER.5 86.01,39.45 93.33,32.13 H4.5
PIC6
  Top 0.305: MICROCONTROLLER.6 88.04,39.96 93.33,34.67 H4.6
PIC8
  Top 0.305: MICROCONTROLLER.8 92.45,40.95 93.64,39.76 H4.8
PIC11
  Top 0.305: MICROCONTROLLER.11 88.44,42.45 93.36,47.38 H4.11
PIC12
  Top 0.305: MICROCONTROLLER.12 86.41,42.96 93.36,49.91 H4.12
PIC13
  Top 0.305: MICROCONTROLLER.13 84.37,43.46 93.36,52.45 H4.13
PIC14
  Top 0.305: MICROCONTROLLER.14 82.32,43.95 93.36,54.99 H4.14
PIC15
  Top 0.305: MICROCONTROLLER.15 80.28,44.45 93.36,57.53 H4.15
PIC16
  Top 0.305: H4.16 94.18,60.08 MICROCONTROLLER.16
PIC17
  Top 0.305: MICROCONTROLLER.17 77.08,46.97 92.29,62.18 H3.1
PIC18
  Top 0.305: MICROCONTROLLER.18 76.57,48.05 89.75,61.23 H3.2
PIC21
  Top 0.305: MICROCONTROLLER.21 75.08,54.17 82.13,61.23 H3.5
PIC22
  Top 0.305: MICROCONTROLLER.22 74.57,56.2 79.59,61.23 H3.6
PIC29
  Top 0.305: MICROCONTROLLER.29 71.06,52.18 61.81,61.42 H3.13
PIC30
  Top 0.305: MICROCONTROLLER.30 70.58,50.12 59.27,61.42 H3.14
PIC31
  Top 0.305: MICROCONTROLLER.31 70.07,48.09 56.73,61.42 H3.15
PIC32
  Top 0.305: MICROCONTROLLER.32 69.56,46.69 54.19,62.06 H3.16
PIC33
  Top 0.305: MICROCONTROLLER.33 67.16,44.96 52.15,59.97 H2.1
PIC39
  Top 0.305: MICROCONTROLLER.39 55.24,41.96 52.47,44.73 H2.7
PIC40
  Top 0.305: MICROCONTROLLER.40 53.84,41.46 53.1,42.19 H2.8
PIC43
  Top 0.305: MICROCONTROLLER.43 57.69,39.96 52.3,34.57 H2.11
PIC44
  Top 0.305: MICROCONTROLLER.44 59.72,39.45 52.3,32.03 H2.12
PIC45
  Top 0.305: MICROCONTROLLER.45 62.07,38.94 52.62,29.49 H2.13
PIC46
  Top 0.305: MICROCONTROLLER.46 64.13,38.46 52.62,26.95 H2.14
PIC47
  Top 0.305: MICROCONTROLLER.47 66.16,37.95 52.62,24.41 H2.15
PIC48
  Top 0.305: 67.4,37.44 MICROCONTROLLER.48 52.01,21.87 H2.16
PIC59
  Top 0.305: H1.11 74.57,34.04 MICROCONTROLLER.59
PIC60
  Top 0.305: H1.12 75.08,34.16 MICROCONTROLLER.60
PIC63
  Top 0.305: H1.15 76.57,34.57 MICROCONTROLLER.63
PIC64
  Top 0.305: H1.16 77.08,34.7 MICROCONTROLLER.64
R-OUT
  Top 0.305: C7.1 20,62.91 H9.1 23.07,64.98 arc-90 R-OUT.MP 23.23,64.82 29.69,64.82 30.48,64.02 C8.+
REC-L  (via drill 0.6)
  Top 0.305: U$3.7 34.28,14.77 H6.3 | 42.7,3.86 H13.3 39.37,7.51 v38.58,7.51
  Bottom 0.305: H6.3 37.5,15.57 38.58,14.49 v38.58,7.51
REC-R
  Top 0.305: U$1.7 46.48,14.62 H7.3
  Bottom 0.305: H13.2 45.4,5.92 47.62,8.14 49.53,8.14 50.16,8.78 50.16,13.86 48.89,15.13 47.62,15.13 H7.3
RS
  Top 0.305: 85.33,5.83 H19.4 85.88,9.92 Q2.2
  Top 0.406: 85.33,5.83 R15.1
RS-PIC  (via drill 0.6)
  Top 0.305: v84.45,11.8 83.96,12.61 Q2.1 | H1.14 76.07,34.44 MICROCONTROLLER.62
  Bottom 0.305: v84.45,11.8 87.11,14.45 H1.14
SCL  (via drill 0.6)
  Top 0.305: MICROCONTROLLER.34 65.77,44.45 52.7,57.52 51.34,57.52 H2.2 50.64,56.81 50.57,56.81 50.16,56.4 46.35,56.4 44.29,58.47 42.43,58.47 H15.6 | v23.49,35.13 29.42,41.06 R2.2 36.95,39.3 v37.31,38.94 | 14.61,27.19 14.61,25.79 U$2.9 14.82,23.17 24.71,13.27 U$3.5 26.84,12.91 26.83,12.91 26.83,8.62 27.78,7.67 35.56,7.67 38.26,10.37 38.26,12.59 38.79,13.12 U$1.5 | 14.61,27.19 14.61,30.53 v16.03,31.96 | 14.61,27.19 12.22,27.19 8.78,23.59 8.59,23.4 H14.4
  Bottom 0.305: v16.03,31.96 18.89,34.81 23.18,34.81 v23.49,35.13 | v37.31,38.94 37.78,39.42 37.78,56.24 38.73,57.2 40.99,57.2 H15.6
SDA/MISO  (via drill 0.6)
  Top 0.305: MICROCONTROLLER.35 63.73,43.95 52.79,54.89 H2.3 51.19,54.82 v48.1,54.82 | v48.1,57.83 46.43,59.35 45,59.35 43.34,61.01 42.43,61.01 H15.4 | H14.3 11.13,20.86 v12.7,22.43 12.7,25.49 U$2.10 | U$3.3 24.98,14.27 22.46,16.8 | 22.46,16.8 17.3,21.8 v17.3,22.43 | U$1.3 38.48,14.12 38.42,14.18 v38.42,18.3 38.42,20.05 38.1,20.37 32.23,20.37 v29.05,17.19 | v23.34,17.67 22.46,16.8 | R1.2 39.33,38.74 v39.05,38.46 | v42.07,21.48 v42.07,18.3
  Bottom 0.305: v48.1,57.83 v48.1,54.82 48.1,51.32 45.72,49.1 40.96,49.1 39.37,47.35 39.37,38.78 v39.05,38.46 39.05,36.4 42.07,33.38 v42.07,21.48 | v12.7,22.43 v17.3,22.43 | v29.05,17.19 23.81,17.19 v23.34,17.67 | v38.42,18.3 v42.07,18.3
XCS
  Top 0.305: MICROCONTROLLER.23 74.08,58.26 77.15,61.33 77.15,62.56 H3.7 72.35,67.36 40,67.36 36.99,64.34 36.99,54.5 38.1,53.39 39.72,53.39 H15.9
XDCS  (via drill 0.6)
  Top 0.305: MICROCONTROLLER.28 71.57,54.37 64.35,61.58 H3.12 64.35,63.96 63.34,64.98 50.96,64.98 47.62,61.64 v47.62,61.17
  Bottom 0.305: v47.62,61.17 47.62,59.9 46.99,59.26 46.99,54.5 45.88,53.39 42.43,53.39 H15.10
XRST  (via drill 0.6)
  Top 0.305: MICROCONTROLLER.27 72.08,55.92 66.89,61.11 H3.11 66.89,63.96 65.25,65.61 49.85,65.61 46.04,61.8 v46.04,61.17
  Bottom 0.305: v46.04,61.17 46.04,57.52 44.45,55.93 42.43,55.93 H15.8

### Text on the board
textBottom: OUT-L | OUT-R | 5v | 5v | GND | MISO | MOSI | SCL | DREQ | XRST | XCS | XDCS | AMP-R | FM-L | FM-R | AMP-L | GND | GND | BT-R | 3v3 | BT-L | SCL | 5v | SDA | 3v3 | FM-L | FM-R | GND | REC-L | REC-R | AUX-L | AUX-R | REC-L | REC-R | BT-L | AUX-R | AUX-L | BT-R | LED- | LED+ | D7 | D0 | E | R/W | RS | GND | 5v | CTR | GND | GND
textTop: Output-L | Output-R | ^ | PICkit | EEE2037 LDPS IV / FM Receiver Project | Ground | 5v Input | Sebastian Goscik / Phil Handley / Stuart Rayner